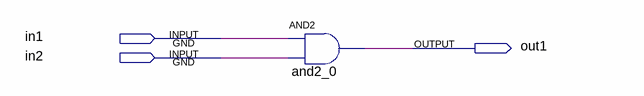
[diagram p0: schematic sheet]
// Quartus schematic and_2.bdf as structural Verilog: 1 symbols, 3 pins
module and_2 (
  input  in1,
  input  in2,
  output out1
);

  and and2_0 (out1, in1, in2);
endmodule
